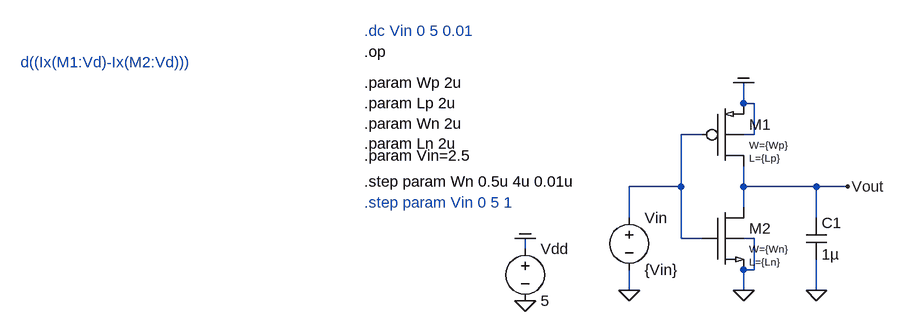
[diagram p0: schematic cmos_inv.asc]
cmos_inv.asc, the LTspice schematic file:
Version 4.1
SHEET 1 1520 680
WIRE 992 16 992 -16
WIRE 1008 16 992 16
WIRE 928 64 896 64
WIRE 1008 64 1008 16
WIRE 1008 64 992 64
WIRE 896 144 896 64
WIRE 896 144 816 144
WIRE 992 144 992 112
WIRE 1104 144 992 144
WIRE 1152 144 1104 144
WIRE 992 176 992 144
WIRE 816 192 816 144
WIRE 1104 192 1104 144
WIRE 896 224 896 144
WIRE 928 224 896 224
WIRE 1008 224 992 224
WIRE 656 240 656 224
WIRE 1008 272 1008 224
WIRE 1008 272 992 272
WIRE 816 304 816 272
WIRE 992 304 992 272
WIRE 1104 304 1104 256
FLAG 992 304 0
FLAG 992 -16 COM
FLAG 656 320 0
FLAG 656 224 COM
FLAG 816 304 0
FLAG 1152 144 Vout
FLAG 1104 304 0
SYMBOL EE551\\NMOS4 928 224 R0
WINDOW 123 73 16 Left 1
WINDOW 39 73 36 Left 1
SYMATTR Value2 W={Wn}
SYMATTR SpiceLine L={Ln}
SYMATTR InstName M2
SYMBOL EE551\\PMOS4 928 64 R0
WINDOW 123 73 16 Left 1
WINDOW 39 73 36 Left 1
SYMATTR Value2 W={Wp}
SYMATTR SpiceLine L={Lp}
SYMATTR InstName M1
SYMBOL voltage 656 224 R0
SYMATTR InstName Vdd
SYMATTR Value 5
SYMBOL voltage 816 176 R0
SYMATTR InstName Vin
SYMATTR Value {Vin}
SYMBOL cap 1088 192 R0
SYMATTR InstName C1
SYMATTR Value 1µ
TEXT 408 -96 Left 2 ;.dc Vin 0 5 0.01
TEXT 408 -16 Left 2 !.param Wp 2u\n.param Lp 2u\n.param Wn 2u\n.param Ln 2u
TEXT 408 136 Left 2 !.step param Wn 0.5u 4u 0.01u
TEXT 408 -64 Left 2 !.op
TEXT -120 -48 Left 2 ;d((Ix(M1:Vd)-Ix(M2:Vd)))
TEXT 408 168 Left 2 ;.step param Vin 0 5 1
TEXT 408 96 Left 2 !.param Vin=2.5

The netlist it stands for:
* cmos_inv.asc
X§M2 Vout N001 0 0 NFET W={Wn} L={Ln}  ; pins Vd Vg Vs Vb
X§M1 Vout N001 COM COM PFET W={Wp} L={Lp}  ; pins Vd Vg Vs Vw
Vdd COM 0 5
Vin N001 0 {Vin}
C1 Vout 0 1µ
* .dc Vin 0 5 0.01
.param Wp 2u
.param Lp 2u
.param Wn 2u
.param Ln 2u
.step param Wn 0.5u 4u 0.01u
.op
* d((Ix(M1:Vd)-Ix(M2:Vd)))
* .step param Vin 0 5 1
.param Vin=2.5
.lib ee551.lib
.backanno
.end

* Results of the author's LTspice run, read from the files saved beside the schematic
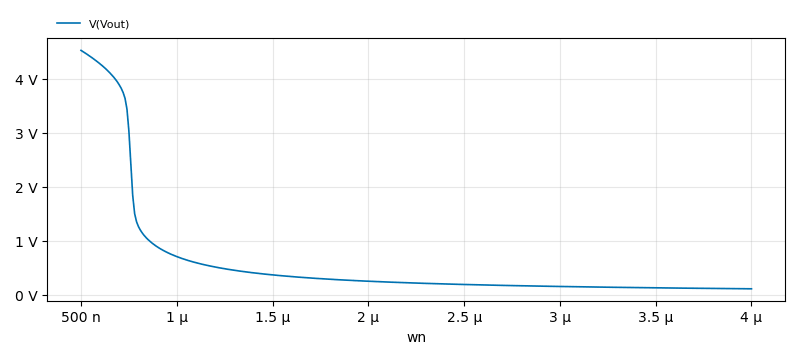
[diagram p1: Operating Point of cmos_inv.asc, plotted from the saved traces]
* Operating Point, 1 run:
*   V(Vout): 4.525 V at wn=500 n, 111 mV at wn=4 µ, min 111 mV, max 4.525 V
* From the log:
*   Semiconductor Device Operating Points:
*                           --- BSIM3 MOSFETS ---
*   Name:       m2:MN       m1:MP
*   Model:      cmosn       cmosp
*   Id:        2.63e-05    2.63e-05
*   Vgs:       2.50e+00   -2.03e+00
*   Vds:       4.53e+00    4.75e-01
*   Vbs:       0.00e+00    4.75e-01
*   Vth:       4.53e-01   -7.78e-01
*   Vdsat:     1.34e+00   -1.44e+00
*   Gm:        2.07e-05    1.35e-05
*   Gds:       3.19e-06    4.54e-05
*   Gmb        6.38e-06    4.59e-06
*   Cbd:       1.45e-15    7.66e-15
*   Cbs:       2.32e-15    6.26e-15
*   Cgsov:     6.29e-17    6.13e-16
*   Cgdov:     6.29e-17    6.13e-16
*   Cgbov:     2.00e-18    2.00e-18
*   dQgdVgb:   1.54e-15    1.62e-14
*   dQgdVdb:  -6.29e-17   -6.41e-15
*   dQgdVsb:  -1.49e-15   -9.64e-15
*   dQddVgb:  -6.54e-16   -7.99e-15
*   dQddVdb:   1.51e-15    1.28e-14
*   dQddVsb:   7.89e-16    4.23e-15
*   dQbdVgb:  -2.32e-16   -1.83e-16
*   dQbdVdb:  -1.45e-15   -1.09e-14
*   dQbdVsb:  -2.47e-15   -5.70e-15